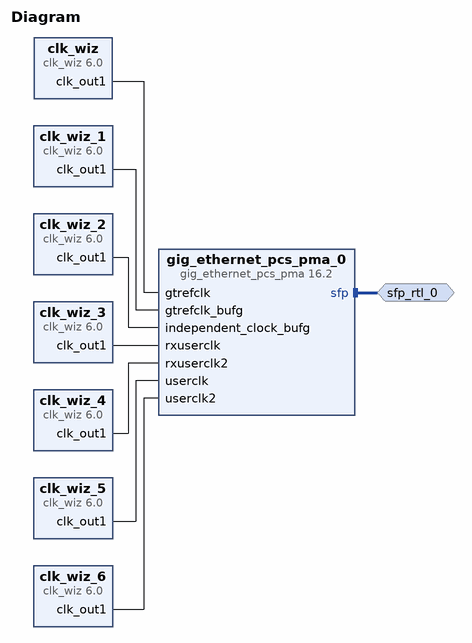
[diagram p0: block diagram of the top level]
# Vivado block design Diagram, xc7vx485tffg1157-1, Vivado 2020.2
create_bd_design Diagram

create_bd_intf_port -mode Master -vlnv xilinx.com:interface:sfp_rtl:1.0 sfp_rtl_0

create_bd_cell -type ip -vlnv xilinx.com:ip:gig_ethernet_pcs_pma:16.2 gig_ethernet_pcs_pma_0
create_bd_cell -type ip -vlnv xilinx.com:ip:clk_wiz:6.0 clk_wiz
create_bd_cell -type ip -vlnv xilinx.com:ip:clk_wiz:6.0 clk_wiz_1
create_bd_cell -type ip -vlnv xilinx.com:ip:clk_wiz:6.0 clk_wiz_2
create_bd_cell -type ip -vlnv xilinx.com:ip:clk_wiz:6.0 clk_wiz_3
create_bd_cell -type ip -vlnv xilinx.com:ip:clk_wiz:6.0 clk_wiz_4
create_bd_cell -type ip -vlnv xilinx.com:ip:clk_wiz:6.0 clk_wiz_5
create_bd_cell -type ip -vlnv xilinx.com:ip:clk_wiz:6.0 clk_wiz_6

# ---- connections ----

connect_bd_intf_net [get_bd_intf_ports sfp_rtl_0] [get_bd_intf_pins gig_ethernet_pcs_pma_0/sfp]
connect_bd_net [get_bd_pins clk_wiz/clk_out1] [get_bd_pins gig_ethernet_pcs_pma_0/gtrefclk]
connect_bd_net [get_bd_pins clk_wiz_1/clk_out1] [get_bd_pins gig_ethernet_pcs_pma_0/gtrefclk_bufg]
connect_bd_net [get_bd_pins clk_wiz_2/clk_out1] [get_bd_pins gig_ethernet_pcs_pma_0/independent_clock_bufg]
connect_bd_net [get_bd_pins clk_wiz_3/clk_out1] [get_bd_pins gig_ethernet_pcs_pma_0/rxuserclk]
connect_bd_net [get_bd_pins clk_wiz_4/clk_out1] [get_bd_pins gig_ethernet_pcs_pma_0/rxuserclk2]
connect_bd_net [get_bd_pins clk_wiz_5/clk_out1] [get_bd_pins gig_ethernet_pcs_pma_0/userclk]
connect_bd_net [get_bd_pins clk_wiz_6/clk_out1] [get_bd_pins gig_ethernet_pcs_pma_0/userclk2]

validate_bd_design
save_bd_design
